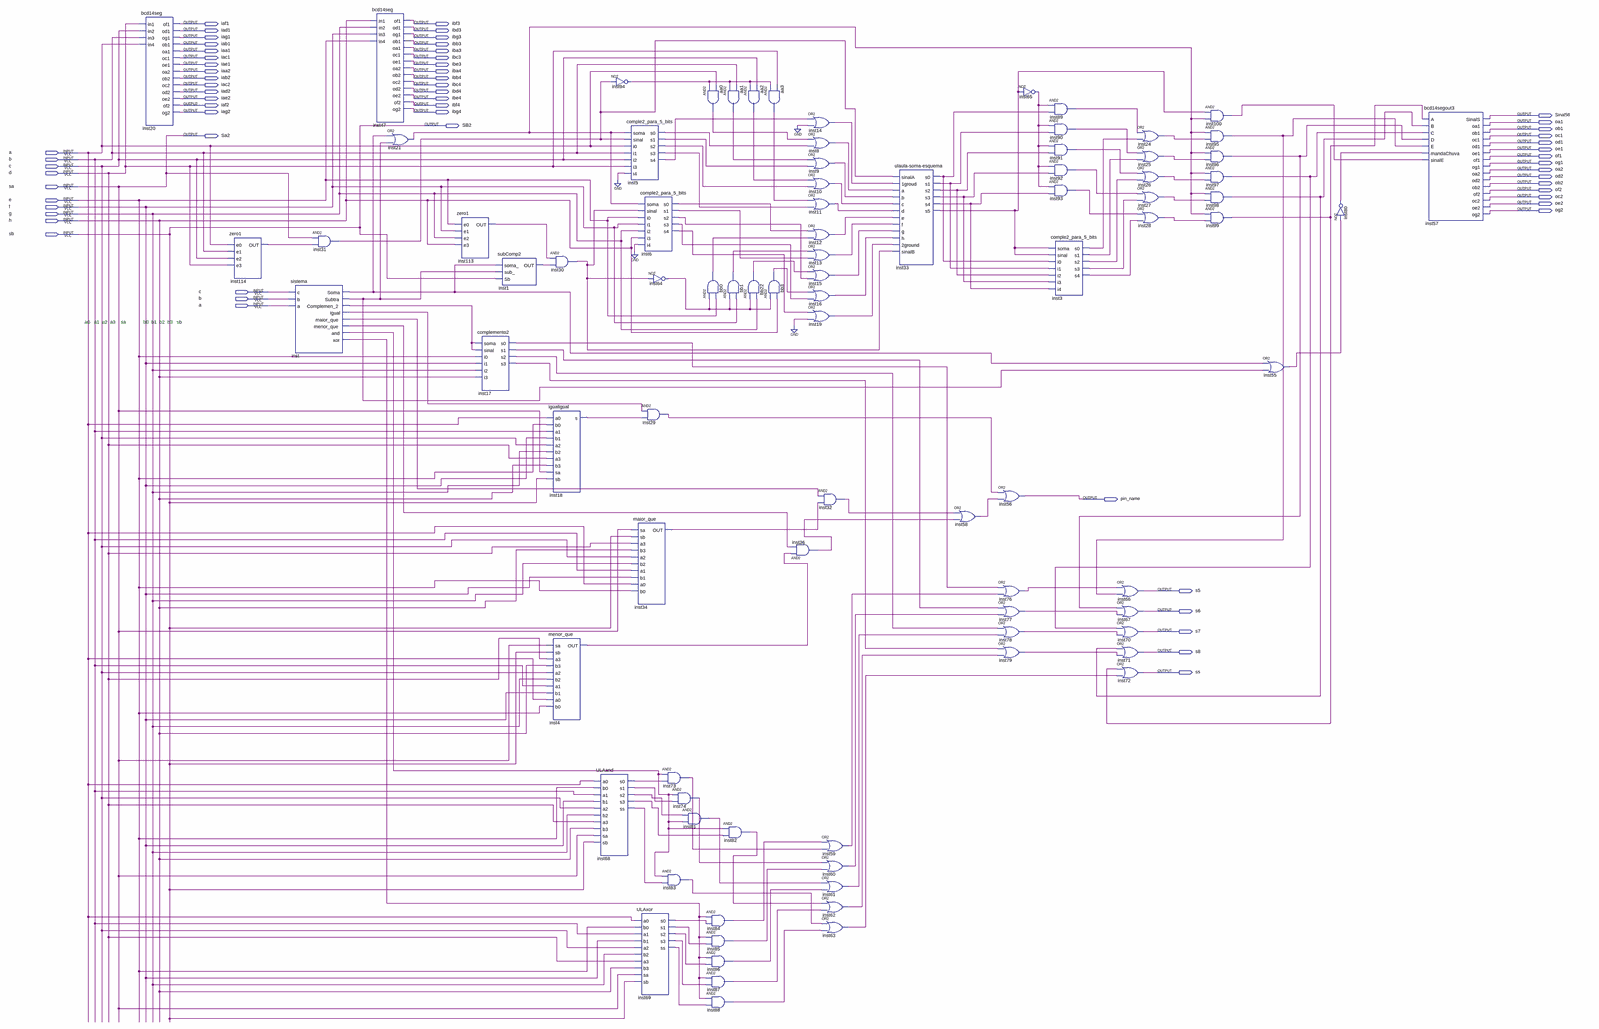
[diagram p0: schematic sheet, whole]
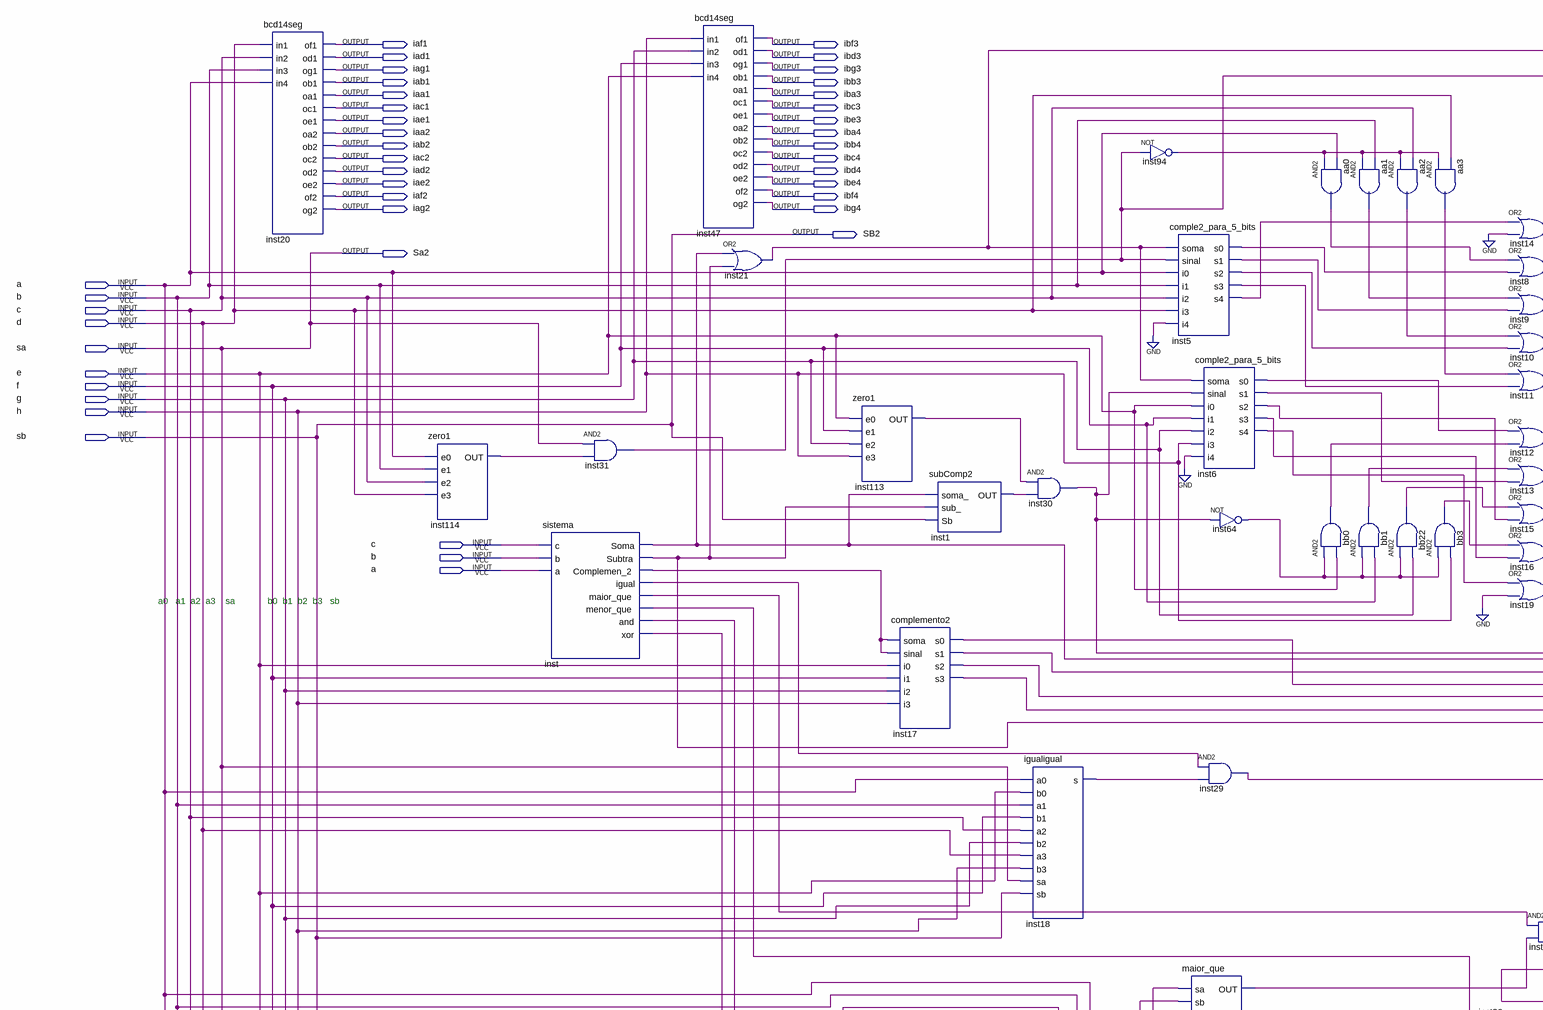
[diagram p1: schematic sheet, upper left part]
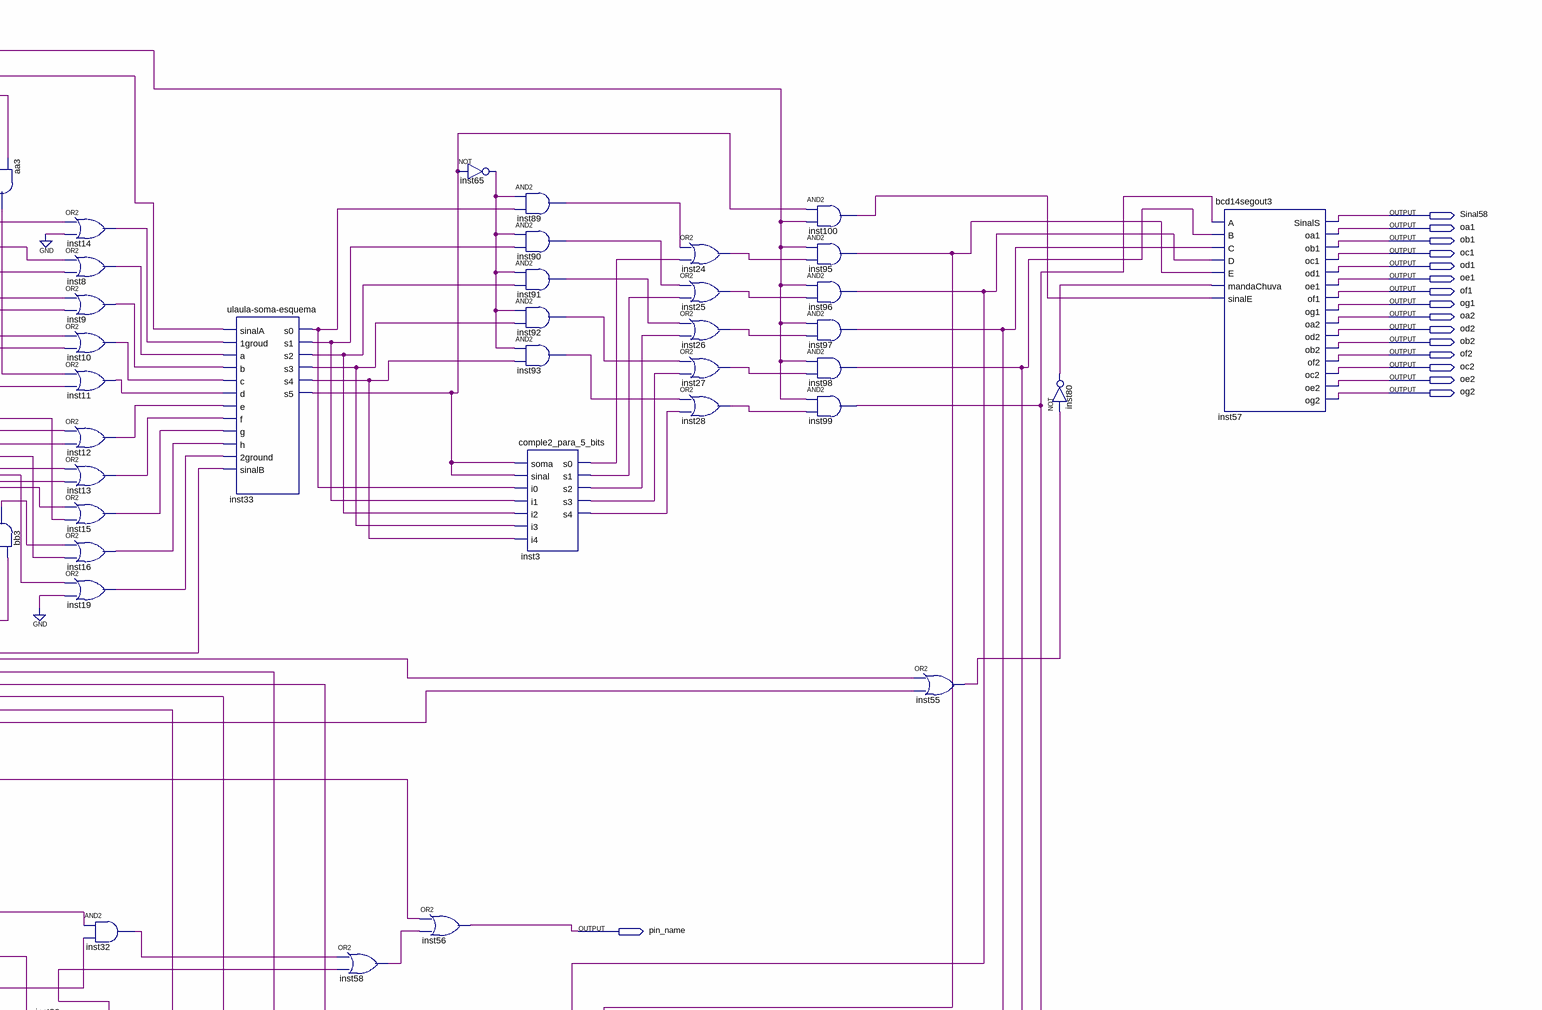
[diagram p2: schematic sheet, upper right part]
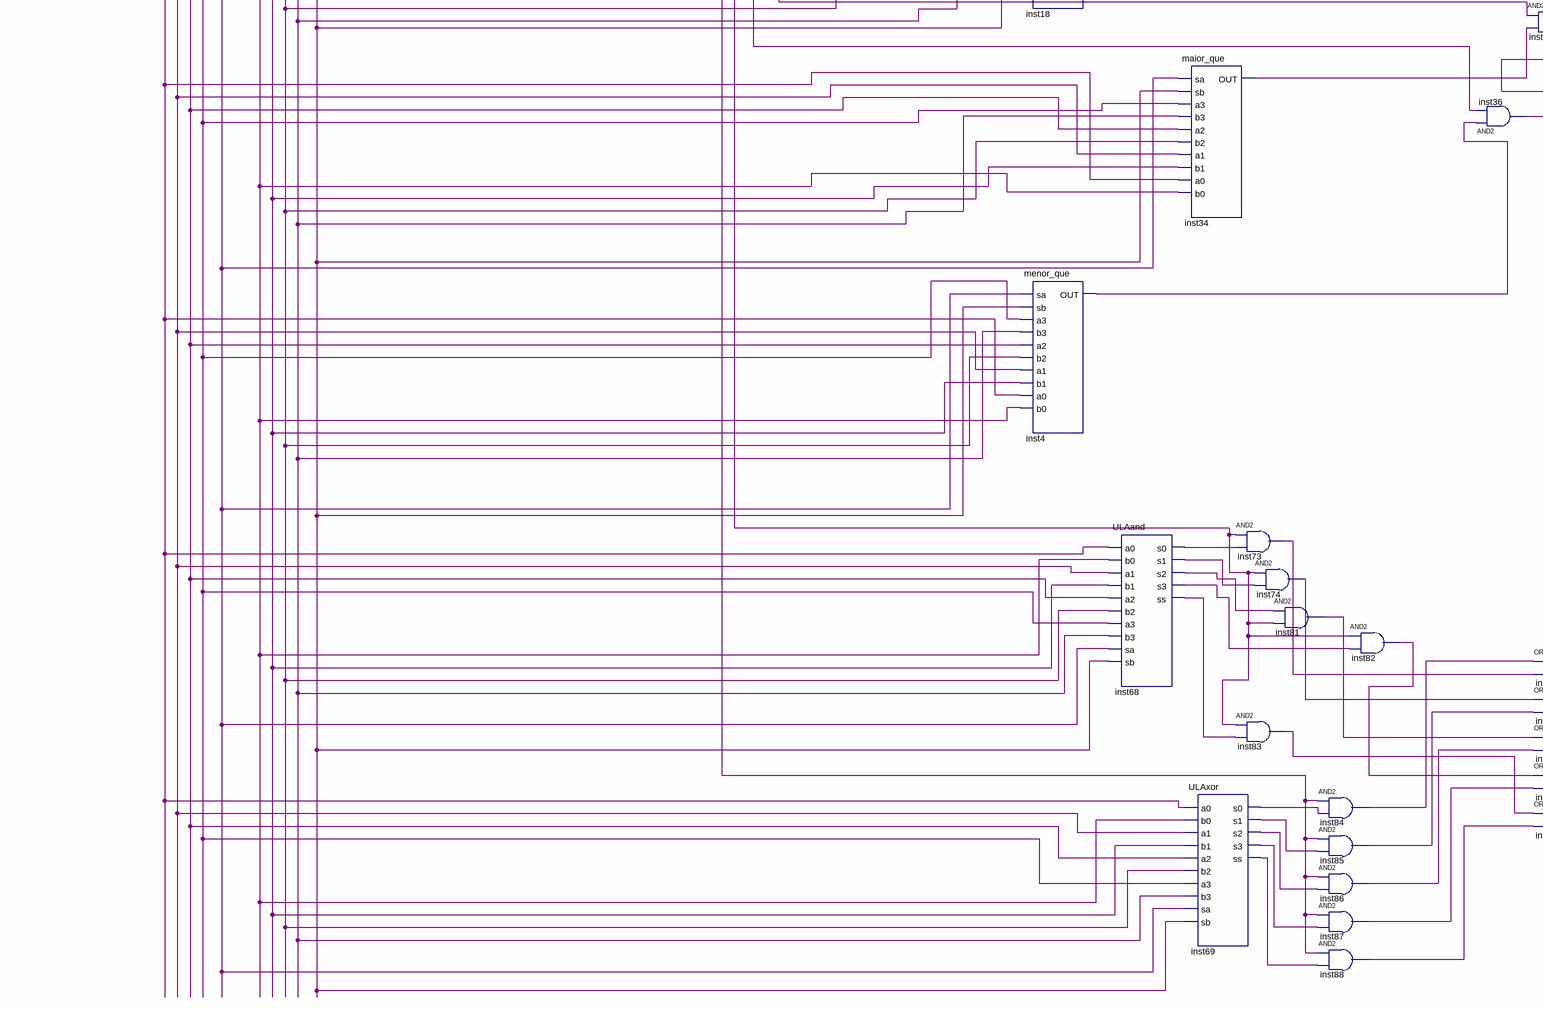
[diagram p3: schematic sheet, lower left part]
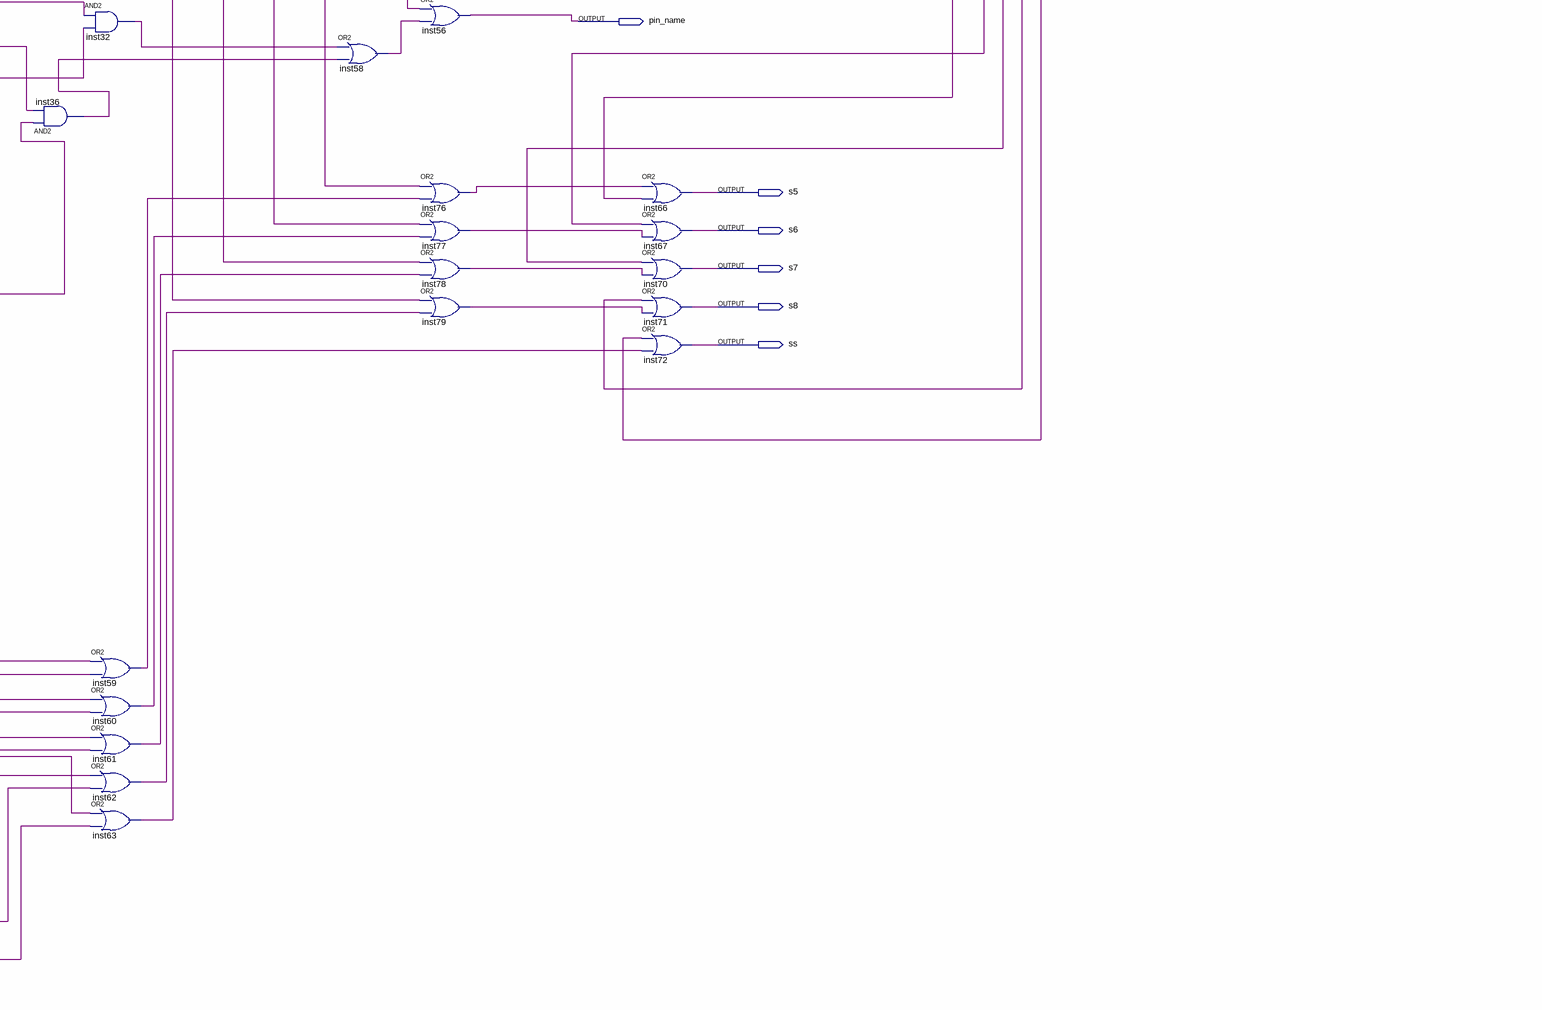
[diagram p4: schematic sheet, lower right part]
// Quartus schematic ULA-Org.bdf as structural Verilog: 88 symbols, 64 pins
module \ULA-Org  (
  input  a,
  input  b,
  input  c,
  input  d,
  input  sa,
  input  e,
  input  f,
  input  g,
  input  h,
  input  sb,
  output iaf1,
  output ibf3,
  output iad1,
  output ibd3,
  output iag1,
  output ibg3,
  output iab1,
  output ibb3,
  output iaa1,
  output iba3,
  output iac1,
  output ibc3,
  output iae1,
  output ibe3,
  output iaa2,
  output iba4,
  output iab2,
  output ibb4,
  output iac2,
  output ibc4,
  output iad2,
  output ibd4,
  output iae2,
  output ibe4,
  output iaf2,
  output ibf4,
  output iag2,
  output ibg4,
  output Sinal58,
  output oa1,
  output SB2,
  output ob1,
  output Sa2,
  output oc1,
  output od1,
  output oe1,
  output of1,
  output og1,
  output oa2,
  output od2,
  output ob2,
  output of2,
  output oc2,
  output oe2,
  output og2,
  output pin_name,
  output s5,
  output s6,
  output s7,
  output s8,
  output ss
);

  wire aa0_out, aa1_out, aa2_out, aa3_out, bb0_out, bb1_out, bb3_out, bb22_out, inst1_out, inst3_s0,
       inst3_s1, inst3_s2, inst3_s3, inst3_s4, inst4_out, inst5_s0, inst5_s1, inst5_s2, inst5_s3, inst5_s4,
       inst6_s0, inst6_s1, inst6_s2, inst6_s3, inst6_s4, inst8_out, inst9_out, inst10_out, inst11_out,
       inst12_out, inst13_out, inst14_out, inst15_out, inst16_out, inst17_s0, inst17_s1, inst17_s2,
       inst17_s3, inst18_s, inst19_out, inst21_out, inst24_out, inst25_out, inst26_out, inst27_out,
       inst28_out, inst29_out, inst30_out, inst31_out, inst32_out, inst33_s0, inst33_s1, inst33_s2,
       inst33_s3, inst33_s4, inst33_s5, inst34_out, inst36_out, inst55_out, inst58_out, inst59_out,
       inst60_out, inst61_out, inst62_out, inst63_out, inst64_out, inst65_out, inst68_s0, inst68_s1,
       inst68_s2, inst68_s3, inst68_ss, inst69_s0, inst69_s1, inst69_s2, inst69_s3, inst69_ss, inst73_out,
       inst74_out, inst76_out, inst77_out, inst78_out, inst79_out, inst80_out, inst81_out, inst82_out,
       inst83_out, inst84_out, inst85_out, inst86_out, inst87_out, inst88_out, inst89_out, inst90_out,
       inst91_out, inst92_out, inst93_out, inst94_out, inst95_out, inst96_out, inst97_out, inst98_out,
       inst99_out, inst100_out, inst113_out, inst114_out, inst_and, inst_complemen_2, inst_igual,
       inst_maior_que, inst_menor_que, inst_soma, inst_subtra, inst_xor;

  bcd14seg inst20 (
    .in1(d), .in2(c), .in3(b), .in4(a), .of1(iaf1), .od1(iad1), .og1(iag1), .ob1(iab1), .oa1(iaa1),
    .oc1(iac1), .oe1(iae1), .oa2(iaa2), .ob2(iab2), .oc2(iac2), .od2(iad2), .oe2(iae2), .of2(iaf2), .og2(iag2));
  zero1 inst114 (.e0(a), .e1(b), .e2(c), .e3(d), .OUT(inst114_out));
  sistema inst (
    .c(c), .b(b), .a(a), .Soma(inst_soma), .Subtra(inst_subtra), .Complemen_2(inst_complemen_2),
    .igual(inst_igual), .maior_que(inst_maior_que), .menor_que(inst_menor_que), .\and (inst_and),
    .\xor (inst_xor));
  and inst31 (inst31_out, sa, inst114_out);
  bcd14seg inst47 (
    .in1(h), .in2(g), .in3(f), .in4(e), .of1(ibf3), .od1(ibd3), .og1(ibg3), .ob1(ibb3), .oa1(iba3),
    .oc1(ibc3), .oe1(ibe3), .oa2(iba4), .ob2(ibb4), .oc2(ibc4), .od2(ibd4), .oe2(ibe4), .of2(ibf4), .og2(ibg4));
  or inst21 (inst21_out, inst_soma, inst_subtra);
  zero1 inst113 (.e0(e), .e1(f), .e2(g), .e3(h), .OUT(inst113_out));
  subComp2 inst1 (.soma_(inst_soma), .sub_(inst_subtra), .Sb(sb), .OUT(inst1_out));
  complemento2 inst17 (
    .soma(inst_complemen_2), .sinal(inst_complemen_2), .i0(e), .i1(f), .i2(g), .i3(h), .s0(inst17_s0),
    .s1(inst17_s1), .s2(inst17_s2), .s3(inst17_s3));
  and inst30 (inst30_out, inst113_out, inst1_out);
  igualigual inst18 (.a0(a), .b0(e), .a1(b), .b1(f), .a2(c), .b2(g), .a3(d), .b3(h), .sa(sa), .sb(sb), .s(inst18_s));
  menor_que inst4 (.sa(sa), .sb(sb), .a3(d), .b3(h), .a2(c), .b2(g), .a1(b), .b1(f), .a0(a), .b0(e), .OUT(inst4_out));
  ULAand inst68 (
    .a0(a), .b0(e), .a1(b), .b1(f), .a2(c), .b2(g), .a3(d), .b3(h), .sa(sa), .sb(sb), .s0(inst68_s0),
    .s1(inst68_s1), .s2(inst68_s2), .s3(inst68_s3), .ss(inst68_ss));
  not inst94 (inst94_out, inst31_out);
  comple2_para_5_bits inst5 (
    .soma(inst21_out), .sinal(inst31_out), .i0(a), .i1(b), .i2(c), .i3(d), .i4(1'b0), .s0(inst5_s0),
    .s1(inst5_s1), .s2(inst5_s2), .s3(inst5_s3), .s4(inst5_s4));
  maior_que inst34 (.sa(sa), .sb(sb), .a3(d), .b3(h), .a2(c), .b2(g), .a1(b), .b1(f), .a0(a), .b0(e), .OUT(inst34_out));
  ULAxor inst69 (
    .a0(a), .b0(e), .a1(b), .b1(f), .a2(c), .b2(g), .a3(d), .b3(h), .sa(sa), .sb(sb), .s0(inst69_s0),
    .s1(inst69_s1), .s2(inst69_s2), .s3(inst69_s3), .ss(inst69_ss));
  comple2_para_5_bits inst6 (
    .soma(inst21_out), .sinal(inst30_out), .i0(e), .i1(f), .i2(g), .i3(h), .i4(1'b0), .s0(inst6_s0),
    .s1(inst6_s1), .s2(inst6_s2), .s3(inst6_s3), .s4(inst6_s4));
  not inst64 (inst64_out, inst30_out);
  and inst29 (inst29_out, inst_igual, inst18_s);
  and inst73 (inst73_out, inst_and, inst68_s0);
  and inst83 (inst83_out, inst_and, inst68_ss);
  and inst74 (inst74_out, inst_and, inst68_s1);
  and inst81 (inst81_out, inst68_s2, inst_and);
  and aa0 (aa0_out, inst94_out, a);
  and bb0 (bb0_out, inst64_out, e);
  and inst84 (inst84_out, inst_xor, inst69_s0);
  and inst85 (inst85_out, inst_xor, inst69_s1);
  and inst86 (inst86_out, inst_xor, inst69_s2);
  and inst87 (inst87_out, inst_xor, inst69_s3);
  and inst88 (inst88_out, inst_xor, inst69_ss);
  and aa1 (aa1_out, inst94_out, b);
  and aa2 (aa2_out, inst94_out, c);
  and bb1 (bb1_out, inst64_out, f);
  and bb22 (bb22_out, inst64_out, g);
  and inst82 (inst82_out, inst_and, inst68_s3);
  and aa3 (aa3_out, inst94_out, d);
  and bb3 (bb3_out, inst64_out, h);
  and inst36 (inst36_out, inst4_out, inst_menor_que);
  or inst14 (inst14_out, inst5_s4, 1'b0);
  or inst8 (inst8_out, aa0_out, inst5_s0);
  or inst9 (inst9_out, aa1_out, inst5_s1);
  or inst10 (inst10_out, aa2_out, inst5_s2);
  or inst11 (inst11_out, aa3_out, inst5_s3);
  or inst12 (inst12_out, inst6_s0, bb0_out);
  or inst13 (inst13_out, bb1_out, inst6_s1);
  or inst15 (inst15_out, bb22_out, inst6_s2);
  or inst16 (inst16_out, bb3_out, inst6_s3);
  or inst19 (inst19_out, inst6_s4, 1'b0);
  and inst32 (inst32_out, inst_maior_que, inst34_out);
  or inst59 (inst59_out, inst84_out, inst73_out);
  or inst60 (inst60_out, inst74_out, inst85_out);
  or inst61 (inst61_out, inst81_out, inst86_out);
  or inst62 (inst62_out, inst82_out, inst87_out);
  or inst63 (inst63_out, inst83_out, inst88_out);
  \ulaula-soma-esquema  inst33 (
    .sinalA(inst31_out), .\1groud (inst14_out), .a(inst8_out), .b(inst9_out), .c(inst10_out), .d(inst11_out),
    .e(inst12_out), .f(inst13_out), .g(inst15_out), .h(inst16_out), .\2ground (inst19_out),
    .sinalB(inst30_out), .s0(inst33_s0), .s1(inst33_s1), .s2(inst33_s2), .s3(inst33_s3), .s4(inst33_s4),
    .s5(inst33_s5));
  or inst58 (inst58_out, inst32_out, inst36_out);
  or inst56 (pin_name, inst29_out, inst58_out);
  or inst76 (inst76_out, inst17_s0, inst59_out);
  or inst77 (inst77_out, inst17_s1, inst60_out);
  or inst78 (inst78_out, inst17_s2, inst61_out);
  or inst79 (inst79_out, inst17_s3, inst62_out);
  not inst65 (inst65_out, inst33_s5);
  and inst89 (inst89_out, inst65_out, inst33_s0);
  and inst90 (inst90_out, inst65_out, inst33_s1);
  and inst91 (inst91_out, inst65_out, inst33_s2);
  and inst92 (inst92_out, inst65_out, inst33_s3);
  and inst93 (inst93_out, inst65_out, inst33_s4);
  comple2_para_5_bits inst3 (
    .soma(inst33_s5), .sinal(inst33_s5), .i0(inst33_s0), .i1(inst33_s1), .i2(inst33_s2), .i3(inst33_s3),
    .i4(inst33_s4), .s0(inst3_s0), .s1(inst3_s1), .s2(inst3_s2), .s3(inst3_s3), .s4(inst3_s4));
  or inst66 (s5, inst76_out, inst95_out);
  or inst67 (s6, inst96_out, inst77_out);
  or inst70 (s7, inst97_out, inst78_out);
  or inst71 (s8, inst98_out, inst79_out);
  or inst72 (ss, inst99_out, inst63_out);
  or inst24 (inst24_out, inst89_out, inst3_s0);
  or inst25 (inst25_out, inst90_out, inst3_s1);
  or inst26 (inst26_out, inst91_out, inst3_s2);
  or inst27 (inst27_out, inst92_out, inst3_s3);
  or inst28 (inst28_out, inst93_out, inst3_s4);
  and inst100 (inst100_out, inst33_s5, inst21_out);
  and inst95 (inst95_out, inst21_out, inst24_out);
  and inst96 (inst96_out, inst21_out, inst25_out);
  and inst97 (inst97_out, inst21_out, inst26_out);
  and inst98 (inst98_out, inst21_out, inst27_out);
  and inst99 (inst99_out, inst21_out, inst28_out);
  or inst55 (inst55_out, inst_soma, inst_subtra);
  not inst80 (inst80_out, inst55_out);
  bcd14segout3 inst57 (
    .A(inst99_out), .B(inst98_out), .C(inst97_out), .D(inst96_out), .E(inst95_out), .mandaChuva(inst80_out),
    .sinalE(inst100_out), .SinalS(Sinal58), .oa1(oa1), .ob1(ob1), .oc1(oc1), .od1(od1), .oe1(oe1), .of1(of1),
    .og1(og1), .oa2(oa2), .od2(od2), .ob2(ob2), .of2(of2), .oc2(oc2), .oe2(oe2), .og2(og2));

  assign Sa2 = sa;
  assign SB2 = sb;

  // Notes on the sheet:
  //   a0   a1  a2  a3    sa             b0  b1  b2  b3   sb
endmodule
